# Altium schematic sheet Gate_Driver.SchDoc
size A4; SheetNumber: 2; SheetTotal: 5
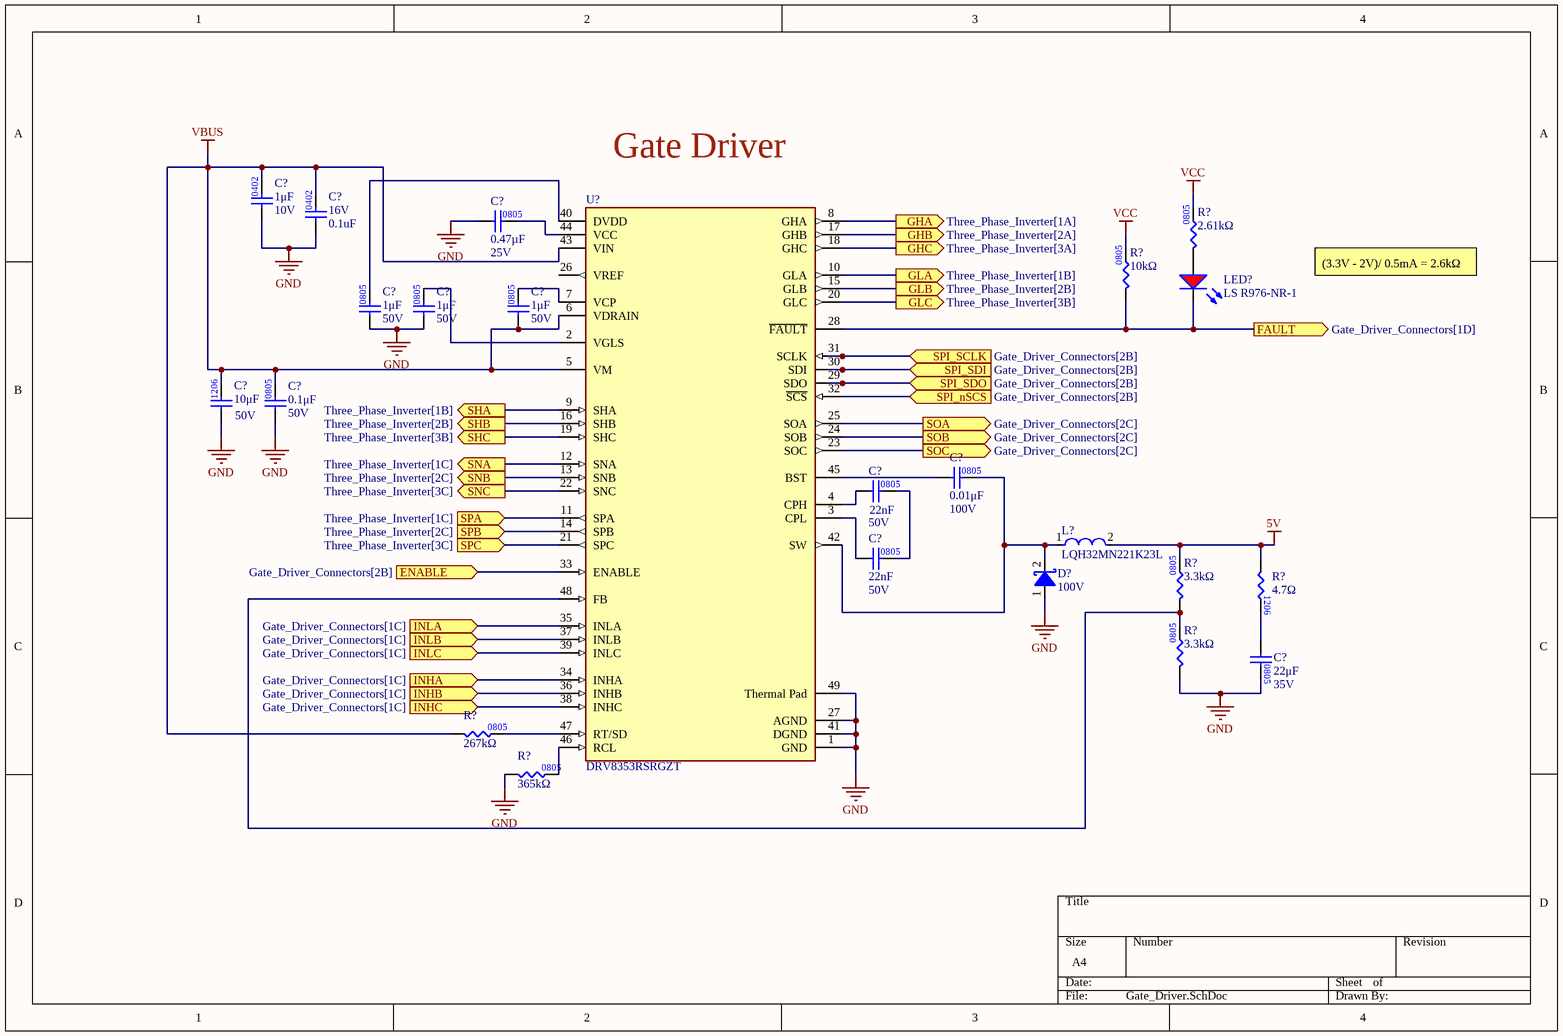
[diagram p0: Gate_Driver.SchDoc]

## Parts
(Parts that share a designator on the sheet are numbered #1, #2 ... from top to bottom, then left to right.)
C?#1  Capacitance: 1μF  Rated DC Voltage (URdc): 10V  [CAP0402]  (hidden comment: CAP_1UF_10V_0402_X5R)
C?#2  value 0.47µF  Voltage Rating: 25V  [CAP0805]  (hidden comment: CAP_0.47uF_25V_0805)
C?#3  Voltage Rating: 16V  Capacitance: 0.1uF  [CAP0402]  (hidden comment: CAP_0.1uF_16V_X7R_0402)
C?#4  value 1μF  Voltage Rating: 50V  [CAP0805]  (hidden comment: CAP_1uF_50V_0805)
C?#5  value 1μF  Voltage Rating: 50V  [CAP0805]  (hidden comment: CAP_1uF_50V_0805)
C?#6  value 1μF  Voltage Rating: 50V  [CAP0805]  (hidden comment: CAP_1uF_50V_0805)
C?#7  value 10μF  Voltage Rating: 50V  [CAP1206]  (hidden comment: CAP_10uF_50V_1206)
C?#8  value 0.1μF  Voltage Rating: 50V  [CAP0805]  (hidden comment: CAP_0.1uF_50V_0805)
C?#9  value 0.01μF  Voltage Rating: 100V  [CAP0805]  (hidden comment: CAP_0.01uF_100V_0805)
C?#10  value 22nF  Voltage Rating: 50V  [CAP2012]  (hidden comment: CAP_22nF_50V_0805_2)
C?#11  value 22nF  Voltage Rating: 50V  [CAP2012]  (hidden comment: CAP_22nF_50V_0805_2)
C?#12  value 22μF  Voltage Rating: 35V  [CAP0805]  (hidden comment: CAP_22uF_35V_0805_±20%)
D?  Vr (Max): 100V  [SOD-123FL]  (hidden comment: DIO_SCHOTTKY_100V_1A)
L?  LQH32MN221K23L  [FP-LQH32CH_23-MFG]
LED?  Manufacturer Part Number 1: LS R976-NR-1  [LED_0805_RED]  (hidden comment: LED_RED)
R?#1  value 2.61kΩ  [RES0805]  (hidden comment: RES_2.61kΩ_0805_1%)
R?#2  value 10kΩ  [RES0805]  (hidden comment: RES_10kΩ_0805_5%)
R?#3  value 4.7Ω  [RES1206]  (hidden comment: RES_4.7Ω_1206_1%)
R?#4  value 3.3kΩ  [RES0805]  (hidden comment: RES_3.3kΩ_0805_1%)
R?#5  value 3.3kΩ  [RES0805]  (hidden comment: RES_3.3kΩ_0805_1%)
R?#6  value 267kΩ  [RES0805]  (hidden comment: RES_267kΩ_0805_1%)
R?#7  value 365kΩ  [RES0805]  (hidden comment: RES_365kΩ_0805_1%)
U?  DRV8353RSRGZT  [FP-RGZ0048L-IPC_A]

## Ports
ENABLE (in, see Gate_Driver_Connectors[2B]), FAULT (out, see Gate_Driver_Connectors[1D]), GHA (out, see Three_Phase_Inverter[1A]), GHB (out, see Three_Phase_Inverter[2A]), GHC (out, see Three_Phase_Inverter[3A]), GLA (out, see Three_Phase_Inverter[1B]), GLB (out, see Three_Phase_Inverter[2B]), GLC (out, see Three_Phase_Inverter[3B]), INHA (in, see Gate_Driver_Connectors[1C]), INHB (in, see Gate_Driver_Connectors[1C]), INHC (in, see Gate_Driver_Connectors[1C]), INLA (in, see Gate_Driver_Connectors[1C]), INLB (in, see Gate_Driver_Connectors[1C]), INLC (in, see Gate_Driver_Connectors[1C]), SHA (out, see Three_Phase_Inverter[1B]), SHB (out, see Three_Phase_Inverter[2B]), SHC (out, see Three_Phase_Inverter[3B]), SNA (out, see Three_Phase_Inverter[1C]), SNB (out, see Three_Phase_Inverter[2C]), SNC (out, see Three_Phase_Inverter[3C]), SOA (out, see Gate_Driver_Connectors[2C]), SOB (out, see Gate_Driver_Connectors[2C]), SOC (out, see Gate_Driver_Connectors[2C]), SPA (in, see Three_Phase_Inverter[1C]), SPB (in, see Three_Phase_Inverter[2C]), SPC (in, see Three_Phase_Inverter[3C]), SPI_nSCS (in, see Gate_Driver_Connectors[2B]), SPI_SCLK (in, see Gate_Driver_Connectors[2B]), SPI_SDI (in, see Gate_Driver_Connectors[2B]), SPI_SDO (in, see Gate_Driver_Connectors[2B])

## Nets
5V: L?.2 R?#3.1 R?#4.2
GND: C?#1.1 C?#2.1 C?#3.1 C?#4.1 C?#5.1 C?#7.1 C?#8.1 C?#12.2 D?.1(Anode) R?#5.1 R?#7.1 U?.1(GND) U?.27(AGND) U?.41(DGND) U?.49(Thermal_Pad)
VBUS: C?#1.2 C?#3.2 C?#6.1 C?#7.2 C?#8.2 R?#6.1 U?.5(VM) U?.6(VDRAIN) U?.43(VIN)
VCC: R?#1.2 R?#2.2
ENABLE: U?.33(ENABLE) ; port ENABLE
FAULT: LED?.2(K) R?#2.1 U?.28(~{FAULT}) ; port FAULT
GHA: U?.8(GHA) ; port GHA
GHB: U?.17(GHB) ; port GHB
GHC: U?.18(GHC) ; port GHC
GLA: U?.10(GLA) ; port GLA
GLB: U?.15(GLB) ; port GLB
GLC: U?.20(GLC) ; port GLC
INHA: U?.34(INHA) ; port INHA
INHB: U?.36(INHB) ; port INHB
INHC: U?.38(INHC) ; port INHC
INLA: U?.35(INLA) ; port INLA
INLB: U?.37(INLB) ; port INLB
INLC: U?.39(INLC) ; port INLC
SHA: U?.9(SHA) ; port SHA
SHB: U?.16(SHB) ; port SHB
SHC: U?.19(SHC) ; port SHC
SNA: U?.12(SNA) ; port SNA
SNB: U?.13(SNB) ; port SNB
SNC: U?.22(SNC) ; port SNC
SOA: U?.25(SOA) ; port SOA
SOB: U?.24(SOB) ; port SOB
SOC: U?.23(SOC) ; port SOC
SPA: U?.11(SPA) ; port SPA
SPB: U?.14(SPB) ; port SPB
SPC: U?.21(SPC) ; port SPC
SPI_nSCS: U?.32(~{SCS}) ; port SPI_nSCS
SPI_SCLK: U?.31(SCLK) ; port SPI_SCLK
SPI_SDI: U?.30(SDI) ; port SPI_SDI
SPI_SDO: U?.29(SDO) ; port SPI_SDO
NetC?#2_2: C?#2.2 U?.44(VCC)
NetC?#4_2: C?#4.2 U?.40(DVDD)
NetC?#5_2: C?#5.2 U?.2(VGLS)
NetC?#6_2: C?#6.2 U?.7(VCP)
NetC?#9_1: C?#9.1 U?.45(BST)
NetC?#9_2: C?#9.2 D?.2(Cathode) L?.1 U?.42(SW)
NetC?#10_1: C?#10.1 U?.4(CPH)
NetC?#10_2: C?#10.2 C?#11.2
NetC?#11_1: C?#11.1 U?.3(CPL)
NetC?#12_1: C?#12.1 R?#3.2
NetLED?_1: LED?.1(A) R?#1.1
NetR?#4_1: R?#4.1 R?#5.2 U?.48(FB)
NetR?#6_2: R?#6.2 U?.47(RT/SD)
NetR?#7_2: R?#7.2 U?.46(RCL)

Not connected (* = marked no-connect by the designer): U? 26(VREF)

## Notes on the sheet
- Gate Driver
- (3.3V - 2V)/ 0.5mA = 2.6kΩ
- (in symbol RES_365kΩ_0805_1%) 0805

## Library data of the parts
C?#1 = CAP_1UF_10V_0402_X5R: CAP CER 1UF 10V X5R 0402; Manufacturer: Kyocera AVX; Manufacturer Part Number: 0402ZD105MAT2A; Supplier 1: Digi-Key; Supplier Part Number 1: 478-5768-1-ND; Mounting Type: Surface Mount; Package: 0402; Temperature Characteristics Code: X5R; ComponentLink7URL: https://datasheet.ciiva.com/11531/cx5r-11531784.pdf?src-supplier=Avnet; ComponentLink7Description: https://datasheet.ciiva.com/11531/cx5r-11531784.pdf?src-supplier=Avnet
C?#2 = CAP_0.47uF_25V_0805: CAP CER 0.47UF 25V X5R 0805; Manufacturer 1: KEMET; Manufacturer Part Number 1: C0805C474K3PAC7800; Package: 0805; Supplier 1: Digi-Key; Supplier Part Number 1: 399-15508-1-ND
C?#3 = CAP_0.1uF_16V_X7R_0402: CAP CER 0.1UF 16V X7R 0402; Supplier 1: Digi-Key; Mounting Type: Surface Mount; Package: 0402
C?#4-C?#6 = CAP_1uF_50V_0805: CAP CER 1UF 50V X7R 0805; Manufacturer Part Number 1: CL21B105KBFNNNG; Manufacturer 1: Samsung Electro-Mechanics; Supplier Part Number 1: 1276-6470-1-ND; Supplier 1: Digi-Key; Mounting Type: SMD; LCSC Part #: C28323; Package: 0805
C?#7 = CAP_10uF_50V_1206: CAP CER 10UF 50V X5R 1206; Manufacturer 1: Murata; Manufacturer Part Number 1: GRT31CR61H106KE01L; Supplier Part Number 1: 490-12456-1-ND; Supplier 1: Digi-Key; Mounting Type: SMD; Package: 1206; Dielectric: X5R
C?#8 = CAP_0.1uF_50V_0805: CAP CER 0.1UF 50V X7R 0805; Manufacturer 1: Murata Electronics; Manufacturer Part Number 1: GCM21BR71H104KA37K; Package/Footprint: 0805; Mounting Type: SMD; Supplier 1: Digi-Key; Supplier Part Number 1: 490-8049-1-ND; Dielectric: X7R; LCSC Part #: C49678
C?#9 = CAP_0.01uF_100V_0805: CAP CER 0.01uF 100V X7R 0805; Manufacturer 1: AVX Corporation; Manufacturer Part Number 1: 08051C103KAT2A; Mounting Type: SMD; Supplier 1: Digi-Key; Supplier Part Number 1: 478-1358-1-ND; Package: 0805; LCSC Part #: C1710; Dielectric: X7R
C?#10 C?#11 = CAP_22nF_50V_0805_2: CAP CER 22nF 50V 0805; Manufacturer Part Number 1: CL21B223KBANFNC; Manufacturer 1: KEMET; Supplier Part Number 1: 1276-2488-1-ND; Supplier 1: Digi-Key; Mounting Type: SMD; Package: 0805
C?#12 = CAP_22uF_35V_0805_±20%: CAP CER 22UF 35V 0805 ±20%; Manufacturer 1: TDK Corporation; Manufacturer Part Number 1: C2012X5R1V226M125AC; Package/Footprint: 0805; Supplier 1: Digi-Key; Supplier Part Number 1: 445-14428-1-ND; Mounting Type: SMD
D? = DIO_SCHOTTKY_100V_1A: DIODE SCHOTTKY 100V 1A SOD-123F; Manufacturer 1: SMC Diode Solutions; Manufacturer Part Number 1: DSS110U; Supplier 1: Digi-Key; Supplier Part Number 1: 1655-DSS110UCT-ND; Mounting Type: SMD; Package/Footprint: SOD-123F
L? = CMP-06042-005447-2: Wire Wound Ferrite Inductor for General Circuits 220μH ±10% 11.8Ω 65mA 1210; Shielding: Unshielded; Series Resistance: 11.8R; Frequency: 5.5MHz; Test Frequency: 1MHz; Inductance: 220uH; Q Factor: 40; RoHS Compliant: Yes; Resistor Type: Wirewound; Mount: Surface Mount; Max Operating Temperature: 85°C; Case Code (Metric): 3225; DC Resistance (DCR): 11.8R; Height: 0.061inch; Width: 2.5mm; Case Code (Imperial): 1210; Height - Seated (Max): 0.087inch; Radiation Hardening: No; Tolerance: 10%; Weight: 0.002116oz; Case/Package: 1210; Military Standard: Not; Length: 3.2mm; DC Current: 65mA; Core Material: Ferrite; Package Quantity: 2000; Min Operating Temperature: -40°C; Packaging: Tape and Reel; Series: LQH32M; Self Resonant Frequency: 5.5MHz; Current Rating: 65mA; Max DC Current: 65mA; Termination: SMD/SMT; Depth: 2.7mm
LED? = LED_RED: LED RED DIFFUSED 0805 SMD; Manufacturer 1: OSRAM; Package/Footprint: 0805; Forward Voltage Drop: 2V; Forward Current: 20mA; Supplier Part Number 1: 475-1278-1-ND; Supplier 1: Digi-Key; Mounting Type: SMD
R?#1 = RES_2.61kΩ_0805_1%: RES 2.61K OHM 1% 1/8W 0805; Manufacturer 1: Vishay Dale; Manufacturer Part Number 1: RC0805FR-072K61L; Package/Footprint: 0805; Supplier 1: Digi-Key; Mounting Type: SMD; Supplier Part Number 1: 311-2.61KCRCT-ND
R?#2 = RES_10kΩ_0805_5%: RES 10K OHM 5% 1/8W 0805; Manufacturer 1: Panasonic Electronic Components; Manufacturer Part Number 1: ERJ-6GEYJ103V; Package/Footprint: 0805; Supplier 1: Digi-Key; Supplier Part Number 1: P10KACT-ND; LCSC Part #: C17414; Mounting Type: SMD
R?#3 = RES_4.7Ω_1206_1%: RES 4.7 OHM 1% 1/2W 1206; Manufacturer 1: Stackpole Electronics Inc; Manufacturer Part Number 1: RNCP1206FTD4R70; Package/Footprint: 1206; Mounting Type: SMD; Supplier 1: Digi-Key; Supplier Part Number 1: RNCP1206FTD4R70CT-ND
R?#4 R?#5 = RES_3.3kΩ_0805_1%: RES 3.3K OHM 1% 1/8W 0805; Manufacturer 1: Vishay Dale; Manufacturer Part Number 1: CRCW06033K30FKEA; Mounting Type: SMD; Supplier 1: Digi-Key; Supplier Part Number 1: 541-3.30KHCT-ND; LCSC Part #: C26010; Package: 0805
R?#6 = RES_267kΩ_0805_1%: RES 267K OHM 1% 1/8W 0805; Manufacturer 1: Yageo; Manufacturer Part Number 1: RC0603FR-071K2L; Supplier 1: Digi-Key; Supplier Part Number 1: 311-267KCRCT-ND; Package: 0805
R?#7 = RES_365kΩ_0805_1%: RES 365K OHM 1% 1/8W 0805; Manufacturer 1: Stackpole Electronics Inc; Manufacturer Part Number 1: RMCF0805FT365K; Supplier 1: Digi-Key; Supplier Part Number 1: RMCF0805FT365KCT-ND
U? = CMP-04912-000076-1: IC MTR DRV MULTIPHAS 6-95V 48QFN; Interface: SPI; Output Current: 25mA; Packaging: Cut Tape; Min Operating Temperature: -40°C; Mount: Surface Mount; Max Operating Temperature: 125°C; Case/Package: VQFN; RoHS Compliant: Yes